# EasyEDA Pro project ProProject_MPF66200 _v0.2_2024-03-13_15-34-52_2024-03-26.epro

# Schematic MPF66200 _v0.2
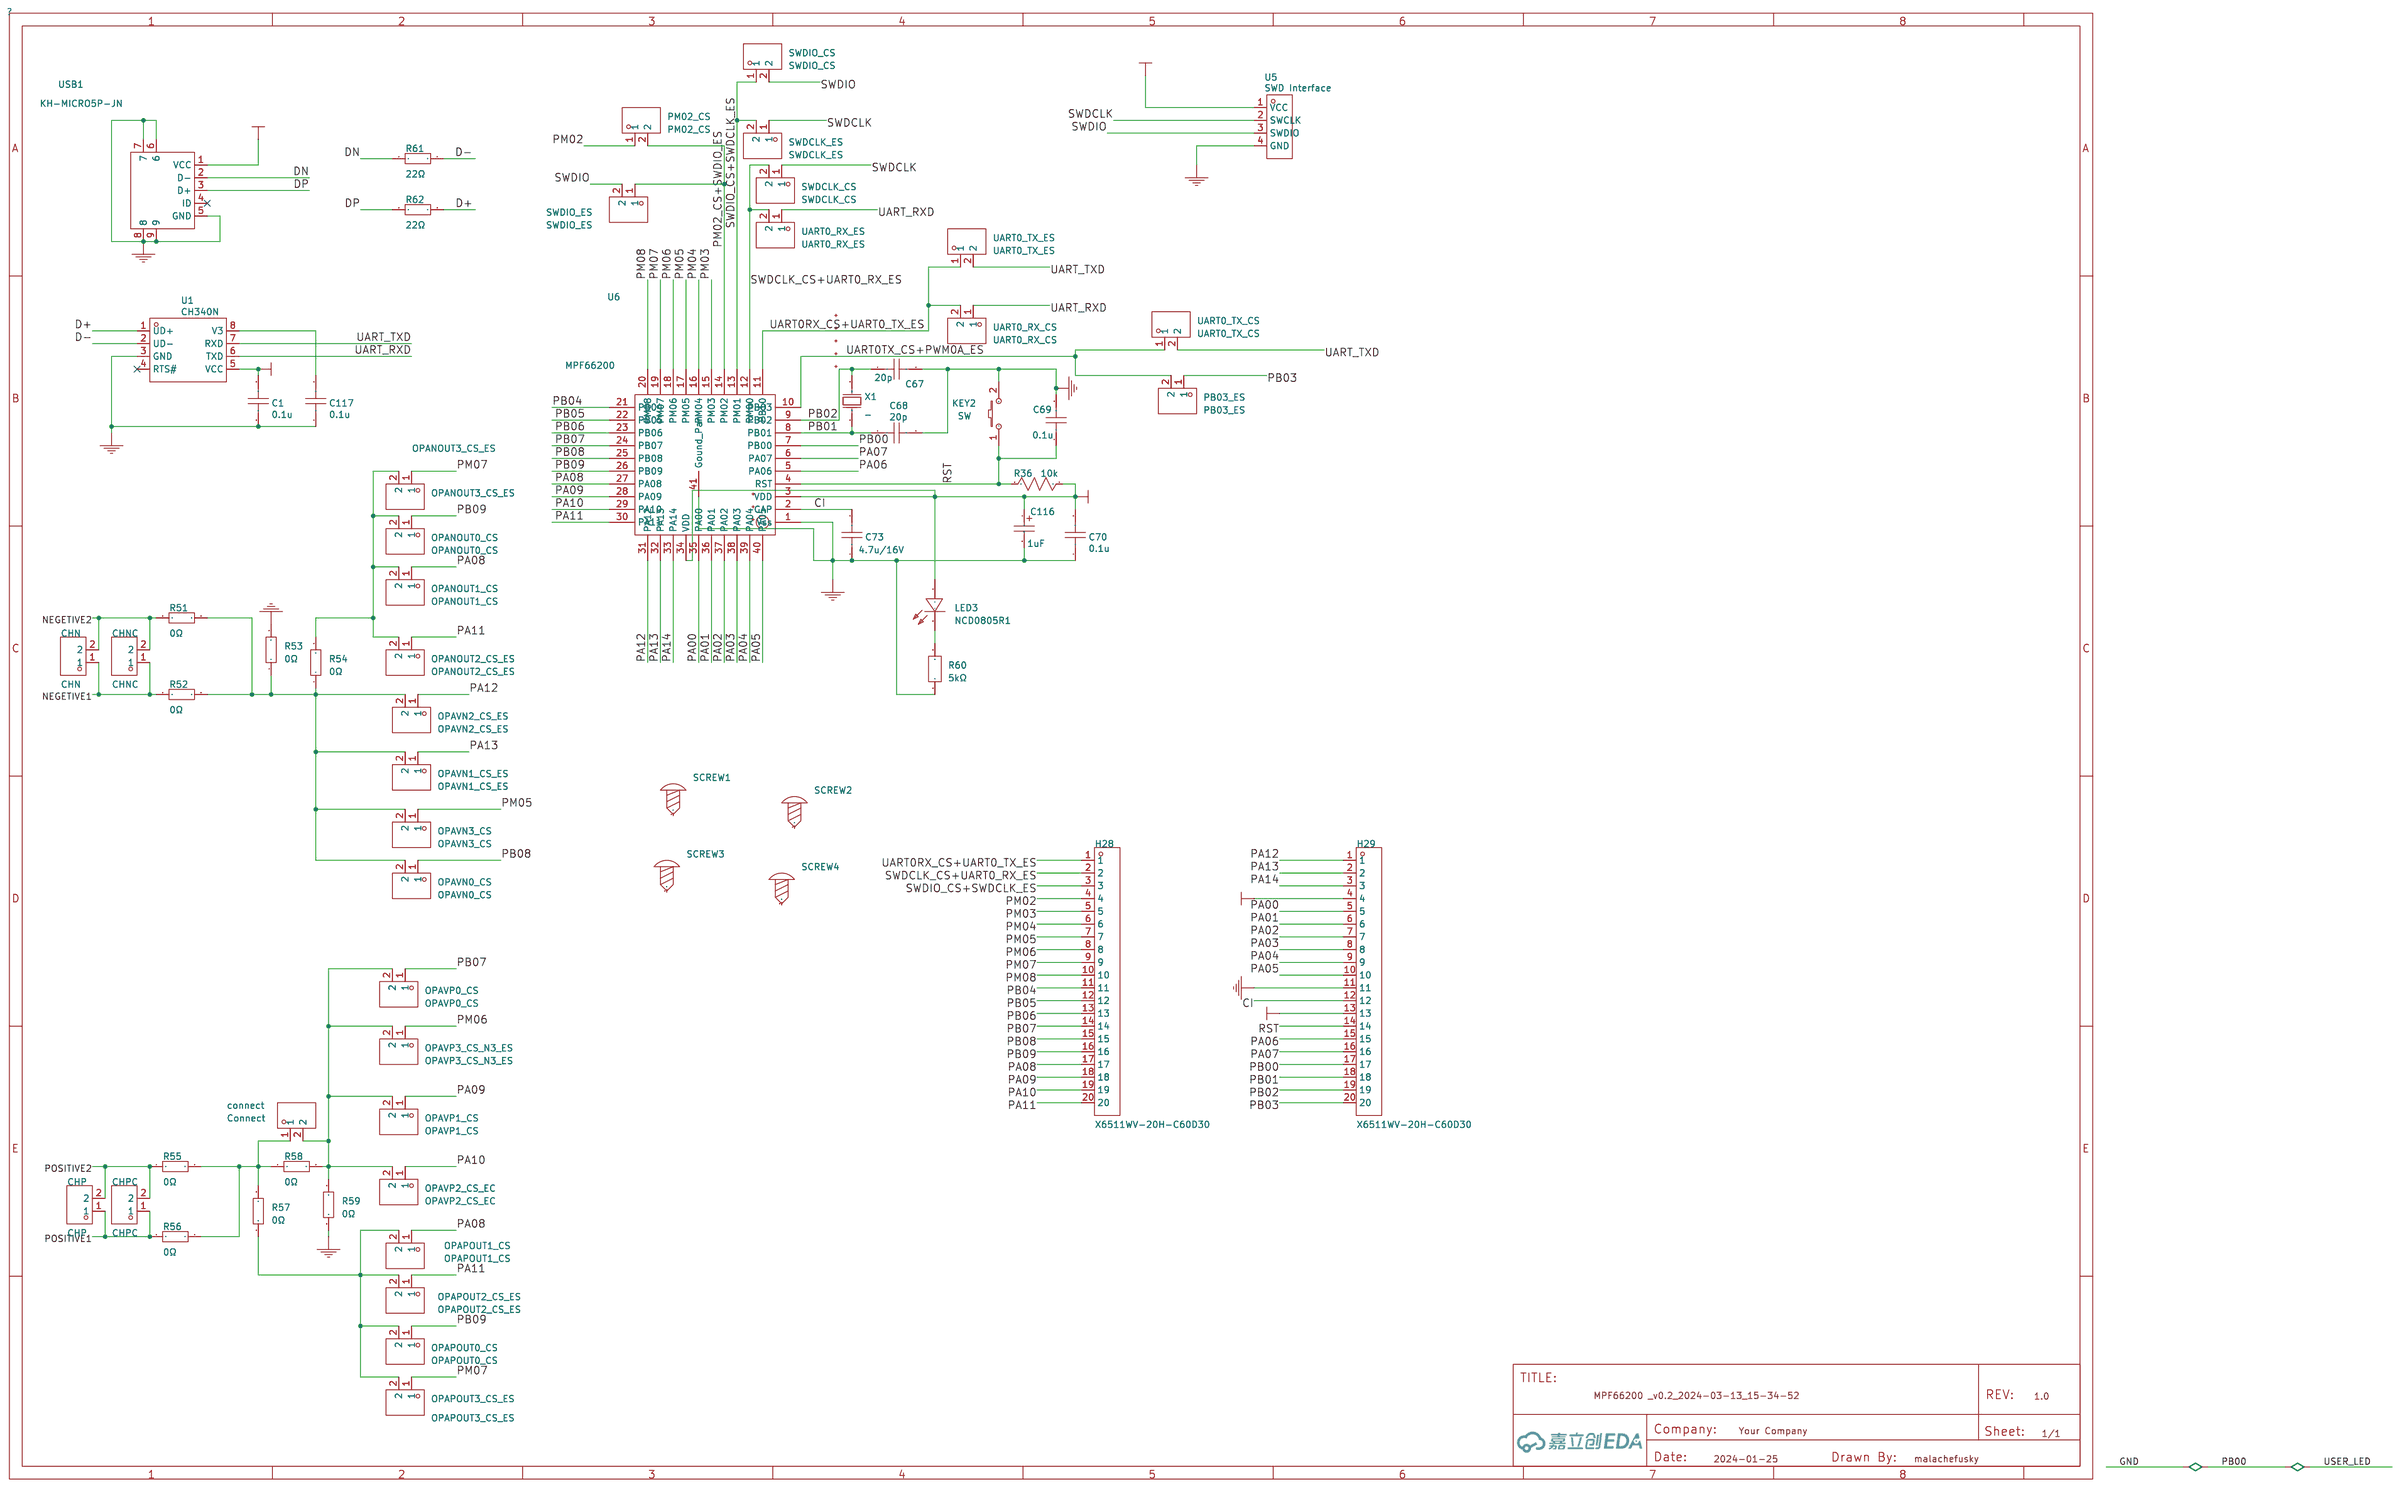
[diagram p0: schematic sheet]

## Parts
C1  0.1u  [C0805]
C67  20p  [C0805]
C68  20p  [C0805]
C69  0.1u  [C0805]
C70  0.1u  [C0805]
C73  4.7u/16V  [C0805]
C116  1uF  [CASE-A_3216]
C117  0.1u  [C0805]
CHN  CHN  [HDR-TH_2P-P2.54-V-M]
CHNC  CHNC  [HDR-TH_2P-P2.54-V-M]
CHP  CHP  [HDR-TH_2P-P2.54-V-M]
CHPC  CHPC  [HDR-TH_2P-P2.54-V-M]
connect  Connect  [HDR-TH_2P-P2.54-V-M]
H28  X6511WV-20H-C60D30  [HDR-TH_20P-P2.54-V-M]
H29  X6511WV-20H-C60D30  [HDR-TH_20P-P2.54-V-M]
KEY2  SW  [KEY-SMD_2P-L6.2-W3.6-LS8.0]
LED3  NCD0805R1  [LED0805-R-RD]
OPANOUT0_CS  OPANOUT0_CS  [HDR-TH_2P-P2.54-V-M]
OPANOUT1_CS  OPANOUT1_CS  [HDR-TH_2P-P2.54-V-M]
OPANOUT2_CS_ES  OPANOUT2_CS_ES  [HDR-TH_2P-P2.54-V-M]
OPANOUT3_CS_ES  OPANOUT3_CS_ES  [HDR-TH_2P-P2.54-V-M]
OPAPOUT0_CS  OPAPOUT0_CS  [HDR-TH_2P-P2.54-V-M]
OPAPOUT1_CS  OPAPOUT1_CS  [HDR-TH_2P-P2.54-V-M]
OPAPOUT2_CS_ES  OPAPOUT2_CS_ES  [HDR-TH_2P-P2.54-V-M]
OPAPOUT3_CS_ES  OPAPOUT3_CS_ES  [HDR-TH_2P-P2.54-V-M]
OPAVN0_CS  OPAVN0_CS  [HDR-TH_2P-P2.54-V-M]
OPAVN1_CS_ES  OPAVN1_CS_ES  [HDR-TH_2P-P2.54-V-M]
OPAVN2_CS_ES  OPAVN2_CS_ES  [HDR-TH_2P-P2.54-V-M]
OPAVN3_CS  OPAVN3_CS  [HDR-TH_2P-P2.54-V-M]
OPAVP0_CS  OPAVP0_CS  [HDR-TH_2P-P2.54-V-M]
OPAVP1_CS  OPAVP1_CS  [HDR-TH_2P-P2.54-V-M]
OPAVP2_CS_EC  OPAVP2_CS_EC  [HDR-TH_2P-P2.54-V-M]
OPAVP3_CS_N3_ES  OPAVP3_CS_N3_ES  [HDR-TH_2P-P2.54-V-M]
PB03_ES  PB03_ES  [HDR-TH_2P-P2.54-V-M]
PM02_CS  PM02_CS  [HDR-TH_2P-P2.54-V-M]
R36  10k  [C0805]
R51  0Ω  [R0805]
R52  0Ω  [R0805]
R53  0Ω  [R0805]
R54  0Ω  [R0805]
R55  0Ω  [R0805]
R56  0Ω  [R0805]
R57  0Ω  [R0805]
R58  0Ω  [R0805]
R59  0Ω  [R0805]
R60  5kΩ  [R0805]
R61  22Ω  [R0805]
R62  22Ω  [R0805]
SCREW1  -  [M2螺丝]
SCREW2  -  [M2螺丝]
SCREW3  -  [M2螺丝]
SCREW4  -  [M2螺丝]
SWDCLK_CS  SWDCLK_CS  [HDR-TH_2P-P2.54-V-M]
SWDCLK_ES  SWDCLK_ES  [HDR-TH_2P-P2.54-V-M]
SWDIO_CS  SWDIO_CS  [HDR-TH_2P-P2.54-V-M]
SWDIO_ES  SWDIO_ES  [HDR-TH_2P-P2.54-V-M]
U1  CH340N  [SOP-8_L5.0-W4.0-P1.27-LS6.0-BL]
U5  SWD Interface  [CONN-TH_4P-P2.50_4PIN]
U6  MPF66200  [VQFN-40_L6.0-W6.0-P0.50-TL-EP4.3]
UART0_RX_CS  UART0_RX_CS  [HDR-TH_2P-P2.54-V-M]
UART0_RX_ES  UART0_RX_ES  [HDR-TH_2P-P2.54-V-M]
UART0_TX_CS  UART0_TX_CS  [HDR-TH_2P-P2.54-V-M]
UART0_TX_ES  UART0_TX_ES  [HDR-TH_2P-P2.54-V-M]
USB1  KH-MICRO5P-JN  [MICRO-USB-SMD_KH-MICRO5P-JN]
X1  -  [HC-49US_L11.5-W4.5-P4.88]

## Library data of the parts
C1 C69 C70 C117 = 0.1u
C67 C68 = 20p
C73 = 4.7u/16V/1u
C116 = 1uF: Supplier: LCSC; Manufacturer: Sunlord(顺络); Manufacturer Part: TC211A105K035Y; Supplier Part: C128315; JLCPCB Part Class: Extended Part
CHN CHNC CHP CHPC connect OPANOUT0_CS OPANOUT1_CS OPANOUT2_CS_ES OPANOUT3_CS_ES OPAPOUT0_CS OPAPOUT1_CS OPAPOUT2_CS_ES OPAPOUT3_CS_ES OPAVN0_CS OPAVN1_CS_ES OPAVN2_CS_ES OPAVN3_CS OPAVP0_CS OPAVP1_CS OPAVP2_CS_EC OPAVP3_CS_N3_ES PB03_ES PM02_CS SWDCLK_CS SWDCLK_ES SWDIO_CS SWDIO_ES UART0_RX_CS UART0_RX_ES UART0_TX_CS UART0_TX_ES = PZ254V-11-02P: 插针结构:1x2P;间距:2.54mm;行距:-;圆针/方针:方针;安装类型:直插;排数:单排;总PIN位数:2P;额定电流:-;额定电压:-;配合针长度:6mm;塑高:2.5mm;端接针长度:3mm;触头材质:黄铜;触头镀层:-;工作温度范围:-40℃~+105℃;颜色:黑色;; LCSC Part Name: 间距:2.54mm 1x2P 直插 方针; Supplier Part: C492401; Manufacturer: XFCN(兴飞); Supplier Footprint: 插件,P=2.54mm; JLCPCB Part Class: 扩展库; Datasheet: https://atta.szlcsc.com/upload/public/pdf/source/20200309/C492401_A812433581A9B211A7FFA413ADDFF0E5.pdf; Supplier: LCSC; Pin Structure: 1x2P; Pitch: 2.54mm; Circluar Pins/Square Pins: 方针; Mounting Type: 直插; Number of Rows: 单排; Number of Pins: 2P; Length of Mating Pin: 6mm; Insulation Height: 2.5mm; Length of End Connection Pin: 3mm; Contact Material: 黄铜; Operating Temperature Range: -40℃~+105℃; Color: 黑色
H28 H29 = X6511WV-20H-C60D30: 插针结构:1x20P;间距:2.54mm;行距:2.54mm;圆针/方针:方针;安装类型:直插;排数:单排;总PIN位数:20P;额定电流:3A;额定电压:250V;配合针长度:6mm;塑高:2.5mm;端接针长度:3mm;触头材质:黄铜;触头镀层:金;工作温度范围:-40℃~+105℃;焊接温度(最大值):260℃;颜色:黑色;; LCSC Part Name: 1x20P 间距:2.54mm 方针 直插; Supplier Part: C725952; Manufacturer: XKB Connection(中国星坤); Supplier Footprint: 插件,P=2.54mm; JLCPCB Part Class: 扩展库; Datasheet: https://atta.szlcsc.com/upload/public/pdf/source/20221108/2FDDF9C694C8EDC81165E23F2EAAE597.pdf; Supplier: LCSC; Pin Structure: 1x20P; Pitch: 2.54mm; Row Spacing: 2.54mm; Circluar Pins/Square Pins: 方针; Mounting Type: 直插; Number of Rows: 单排; Number of Pins: 20P; Current Rating (Max): 3A; Voltage Rating (Max): 250V; Length of Mating Pin: 6mm; Insulation Height: 2.5mm; Length of End Connection Pin: 3mm; Contact Material: 黄铜; Contact Plating: 金; Operating Temperature Range: -40℃~+105℃; Soldering Temperature(Max): 260℃; Color: 黑色
KEY2 = SW: Supplier Part: C118141; Supplier: LCSC; Manufacturer Part: K2-1107ST-A4SW-06; 制造商: 韩国韩荣
LED3 = NCD0805R1: 灯头类型:-;发光颜色:红色;正向电压(VF):1.6V~2.6V;功率:65mW;正向电流:20mA;主波长:615nm~630nm;二极管配置:独立二极管;透镜颜色:无色透明透镜;色温:-;发光强度:67mcd~195mcd;发光角度:130°;载带方式:-;工作温度:-30℃~+85℃;; Supplier Part: C84256; Manufacturer: 国星光电; Supplier Footprint: 0805; JLCPCB Part Class: 基础库; Datasheet: https://atta.szlcsc.com/upload/public/pdf/source/20200820/C84256_F0A75A43B3EAD75808600A0514C76B99.pdf; Supplier: LCSC; Emitted Color: 红色; Forward Voltage (VF): 1.6V~2.6V; Power Dissipation: 65mW; Forward Current: 20mA; Dominant Wavelength: 615nm~630nm; Diode Configuration: 独立二极管; Lens Color: 无色透明透镜; Luminous Intensity: 67mcd~195mcd; Viewing Angle: 130°; Operating Temperature: -30℃~+85℃
R36 = 10k
R51-R59 = 0805W8F0000T5E: 电阻类型:厚膜电阻;阻值:0Ω;精度:±1%;功率:125mW;最大工作电压:150V;温度系数:±800ppm/℃;; LCSC Part Name: 0Ω ±1% 125mW 厚膜电阻; Supplier Part: C17477; Manufacturer: UNI-ROYAL(厚声); Supplier Footprint: 0805; JLCPCB Part Class: 基础库; Datasheet: https://atta.szlcsc.com/upload/public/pdf/source/20200306/C422600_1E6D84923E4A46A82E41ADD87F860B5C.pdf; Supplier: LCSC; Type: 厚膜电阻; Tolerance: ±1%; Power(Watts): 125mW; Overload Voltage (Max): 150V; Temperature Coefficient: ±800ppm/℃; Operating Temperature Range: -55℃~+155℃
R60 = RTT055001FTP: 电阻类型:厚膜电阻;阻值:5kΩ;精度:±1%;功率:125mW;最大工作电压:150V;温度系数:±100ppm/℃;; LCSC Part Name: 厚膜电阻 5kΩ ±1% 125mW; Supplier Part: C332873; Manufacturer: RALEC(旺诠); Supplier Footprint: 0805; JLCPCB Part Class: 扩展库; Datasheet: https://atta.szlcsc.com/upload/public/pdf/source/20191219/C158410_884373A5B7E1BC76BF57BC45A946C093.pdf; Supplier: LCSC; Type: 厚膜电阻; Tolerance: ±1%; Power(Watts): 125mW; Overload Voltage (Max): 150V; Temperature Coefficient: ±100ppm/℃; Operating Temperature Range: -55℃~+155℃
R61 R62 = 0805W8F220JT5E: 电阻类型:厚膜电阻;阻值:22Ω;精度:±1%;功率:125mW;最大工作电压:150V;温度系数:±100ppm/℃;; LCSC Part Name: 22Ω ±1% 125mW 厚膜电阻; Supplier Part: C17561; Manufacturer: UNI-ROYAL(厚声); Supplier Footprint: 0805; JLCPCB Part Class: 基础库; Datasheet: https://atta.szlcsc.com/upload/public/pdf/source/20200306/C422600_1E6D84923E4A46A82E41ADD87F860B5C.pdf; Supplier: LCSC; Type: 厚膜电阻; Tolerance: ±1%; Power(Watts): 125mW; Overload Voltage (Max): 150V; Temperature Coefficient: ±100ppm/℃; Operating Temperature Range: -55℃~+155℃
SCREW1-SCREW4 = M2螺丝: Supplier Footprint: 插件
U1 = CH340N: Supplier: LCSC; Supplier Part: C506813; Manufacturer: WCH(南京沁恒); JLCPCB Part Class: Extended Part
U5 = SWD Interface: Supplier: LCSC; Supplier Part: C7429634; Manufacturer: Megastar(兆星); Manufacturer Part: ZX-XH2.54-4PZZ; JLCPCB Part Class: Extended Part
U6 = MPF66200
USB1 = KH-MICRO5P-JN: Supplier: LCSC; Supplier Part: C962222; Manufacturer: Shenzhen Kinghelm Elec; JLCPCB Part Class: Extended Part
X1 = -: Supplier: LCSC; Manufacturer: HOSONIC(鸿星); Manufacturer Part: E49A25E00000XE10C0; Supplier Part: C112385; JLCPCB Part Class: Extended Part

## Nets
+5V: C1.2 C70.2 C116.1 H29.4 H29.13 LED3.1(+) R36.1 U1.5(VCC) U5.1(VCC) U6.3(VDD) U6.34(VDD) USB1.1(VCC)
GND: C1.1 C67.2 C68.2 C69.2 C70.1 C73.1 C116.2 C117.1 H29.11 H29.17 KEY2.2 R53.2 R59.1 R60.1 U1.3(GND) U5.4(GND) U6.1(Vss) U6.7(PB00) U6.41(Gound Pan) USB1.5(GND) USB1.6 USB1.7 USB1.8 USB1.9
CI: C73.2 H29.12 U6.2(CAP)
D+: R62.2 U1.1(UD+)
D-: R61.2 U1.2(UD-)
DN: R61.1 USB1.2(D-)
DP: R62.1 USB1.3(D+)
NEGETIVE1: CHN.1 CHNC.1 R52.1
NEGETIVE2: CHN.2 CHNC.2 R51.1
PA00: H29.5 U6.35(PA00)
PA01: H29.6 U6.36(PA01)
PA02: H29.7 U6.37(PA02)
PA03: H29.8 U6.38(PA03)
PA04: H29.9 U6.39(PA04)
PA05: H29.10 U6.40(PA05)
PA06: H29.15 U6.5(PA06)
PA07: H29.16 U6.6(PA07)
PA08: H28.17 OPANOUT1_CS.1 OPAPOUT1_CS.1 U6.27(PA08)
PA09: H28.18 OPAVP1_CS.1 U6.28(PA09)
PA10: H28.19 OPAVP2_CS_EC.1 U6.29(PA10)
PA11: H28.20 OPANOUT2_CS_ES.1 OPAPOUT2_CS_ES.1 U6.30(PA11)
PA12: H29.1 OPAVN2_CS_ES.1 U6.31(PA12)
PA13: H29.2 OPAVN1_CS_ES.1 U6.32(PA13)
PA14: H29.3 U6.33(PA14)
PB01: C68.1 H29.18 U6.8(PB01) X1.1(OSC1)
PB02: C67.1 H29.19 U6.9(PB02) X1.2(OSC2)
PB03: H29.20 PB03_ES.1
PB04: H28.11 U6.21(PB04)
PB05: H28.12 U6.22(PB05)
PB06: H28.13 U6.23(PB06)
PB07: H28.14 OPAVP0_CS.1 U6.24(PB07)
PB08: H28.15 OPAVN0_CS.1 U6.25(PB08)
PB09: H28.16 OPANOUT0_CS.1 OPAPOUT0_CS.1 U6.26(PB09)
PM02: H28.4 PM02_CS.1
PM02_CS+SWDIO_ES: PM02_CS.2 SWDIO_ES.1 U6.14(PM02)
PM03: H28.5 U6.15(PM03)
PM04: H28.6 U6.16(PM04)
PM05: H28.7 OPAVN3_CS.1 U6.17(PM05)
PM06: H28.8 OPAVP3_CS_N3_ES.1 U6.18(PM06)
PM07: H28.9 OPANOUT3_CS_ES.1 OPAPOUT3_CS_ES.1 U6.19(PM07)
PM08: H28.10 U6.20(PM08)
POSITIVE1: CHP.1 CHPC.1 R56.1
POSITIVE2: CHP.2 CHPC.2 R55.1
RST: C69.1 H29.14 KEY2.1 R36.2 U6.4(RST)
SWDCLK: SWDCLK_CS.1 SWDCLK_ES.1 U5.2(SWCLK)
SWDCLK_CS+UART0_RX_ES: H28.2 SWDCLK_CS.2 U6.12(PM00) UART0_RX_ES.2
SWDIO: SWDIO_CS.2 SWDIO_ES.2 U5.3(SWDIO)
SWDIO_CS+SWDCLK_ES: H28.3 SWDCLK_ES.2 SWDIO_CS.1 U6.13(PM01)
UART0RX_CS+UART0_TX_ES: H28.1 U6.11(PB10) UART0_RX_CS.2 UART0_TX_ES.1
UART0TX_CS+PWM0A_ES: PB03_ES.2 U6.10(PB03) UART0_TX_CS.1
UART_RXD: U1.6(TXD) UART0_RX_CS.1 UART0_RX_ES.1
UART_TXD: U1.7(RXD) UART0_TX_CS.2 UART0_TX_ES.2
$1N13: LED3.2(-) R60.2
$1N1417: C117.2 U1.8(V3)
$1N4052: OPAPOUT0_CS.2 OPAPOUT1_CS.2 OPAPOUT2_CS_ES.2 OPAPOUT3_CS_ES.2 R57.1
$1N5089: OPAVN0_CS.2 OPAVN1_CS_ES.2 OPAVN2_CS_ES.2 OPAVN3_CS.2 R51.2 R52.2 R53.1 R54.1
$1N10460: OPANOUT0_CS.2 OPANOUT1_CS.2 OPANOUT2_CS_ES.2 OPANOUT3_CS_ES.2 R54.2
$1N10784: connect.1 R55.2 R56.2 R57.2 R58.1
$1N10794: connect.2 OPAVP0_CS.2 OPAVP1_CS.2 OPAVP2_CS_EC.2 OPAVP3_CS_N3_ES.2 R58.2 R59.2

Not connected (* = marked no-connect by the designer): SCREW1 1; SCREW2 1; SCREW3 1; SCREW4 1; U1 4(RTS#)*; USB1 4(ID)*

# Board PCB2
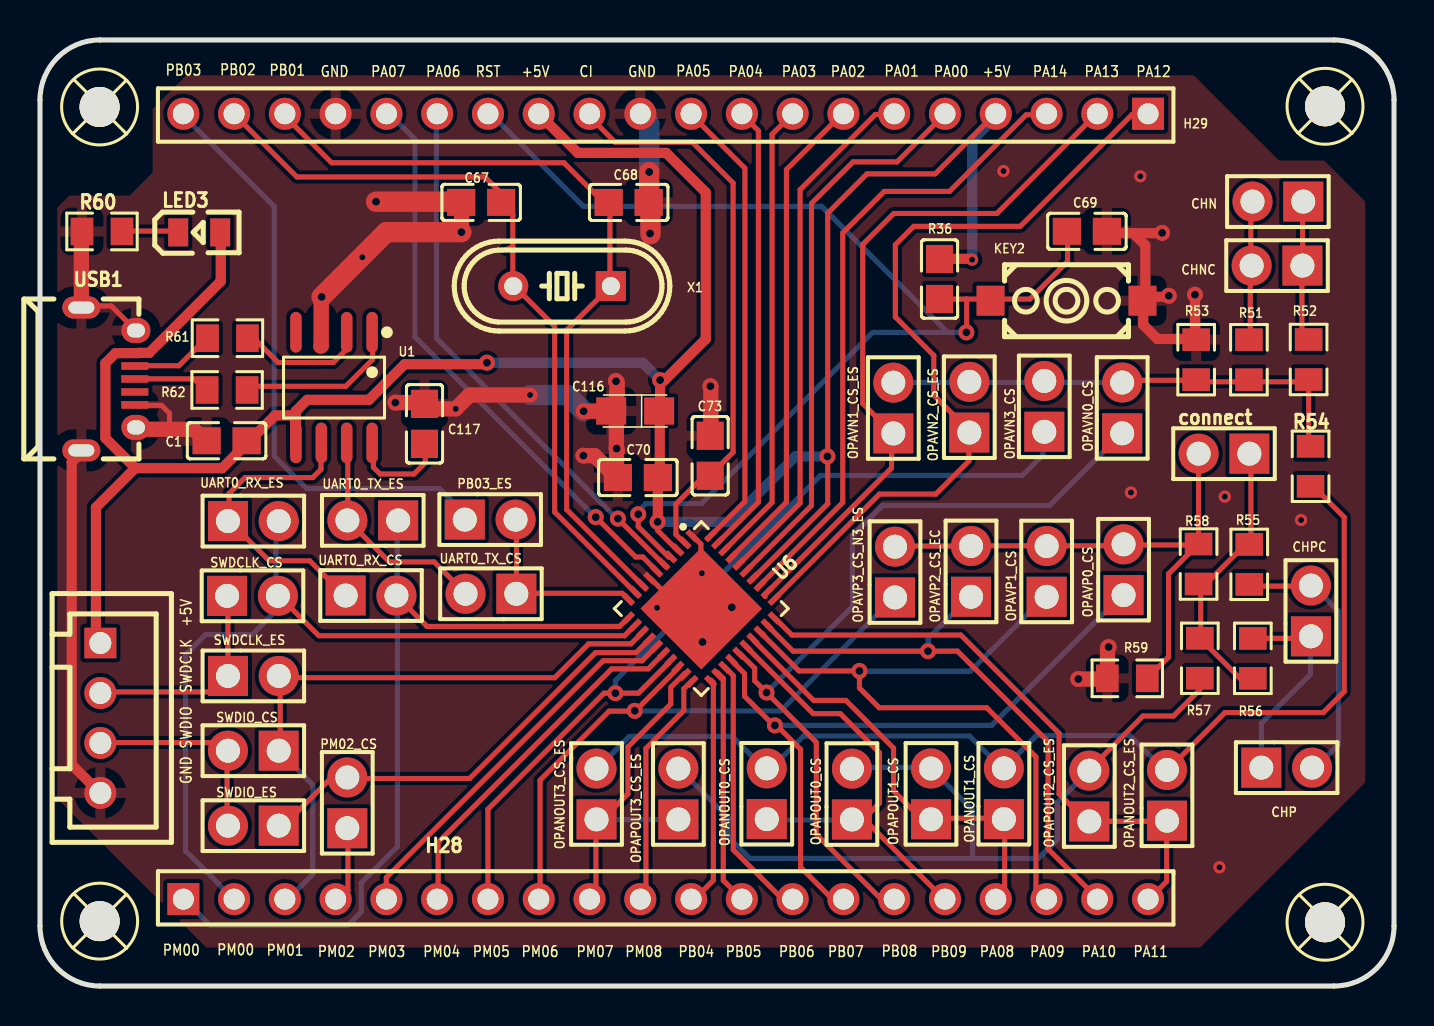
[diagram p1: board, top side]
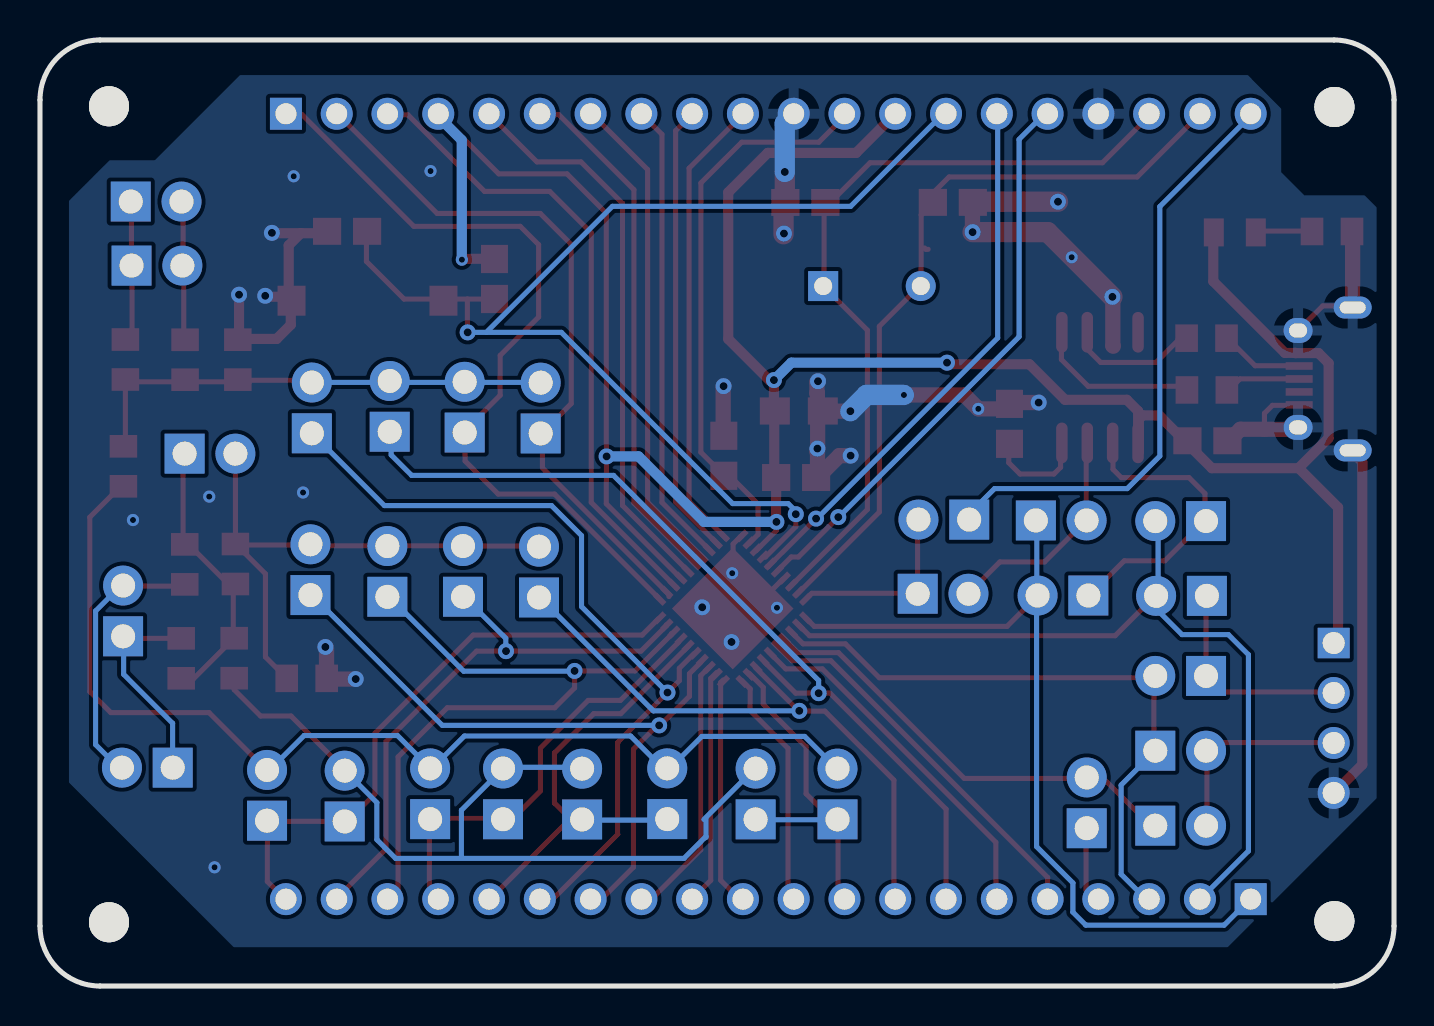
[diagram p2: board, bottom side, seen from below]

Outline 67.73 x 47.34 mm; copper layers: Top Layer, Bottom Layer. Coordinates in mm from the lower left corner of the outline.
Outline path: 0,44.34 0,3 arc(0.88,0.88) 3,0 64.73,0 arc(66.85,0.88) 67.73,3 67.73,44.34 arc(66.85,46.46) 64.73,47.34 3,47.34 arc(0.88,46.46) 0,44.34
Stack: Top Layer 0.035mm / Dielectric1 1.51mm FR4 er 4.5 / Bottom Layer 0.035mm

## Design rules (mm)
template: JLCPCB Capability(Two Layers Board)
spacing copperThickness1oz (default): track to track 0.102, other pairs 0.152 to 0.3
spacing copperThickness2oz: track to track 0.203, other pairs 0.152 to 0.3
track width copperThickness1oz (default): min 0.127, default 0.254, max 2.54
track width copperThickness2oz: min 0.203, default 0.254, max 2.54
differential pair differentialPair (default): width min 0.127, default 0.254, max 2.54; gap min 0.152, default 0.152
via viaSize (default): diameter min 0.5, default 0.61, max 10; hole min 0.3, default 0.305, max 6.3

## Placement (name value [footprint] x y rotation side)
C1  0.1u  [C0805]  9.33 27.28 0 top
C67  20p  [C0805]  22.07 39.21 180 top
C68  20p  [C0805]  29.45 39.21 0 top
C69  0.1u  [C0805]  52.37 37.76 0 top
C70  0.1u  [C0805]  29.91 25.44 0 top
C73  4.7u/16V  [C0805]  33.52 26.53 270 top
C116  1uF  [CASE-A_3216]  29.77 28.77 180 top
C117  0.1u  [C0805]  19.24 28.13 270 top
CHN  CHN  [HDR-TH_2P-P2.54-V-M]  61.92 39.25 180 top
CHNC  CHNC  [HDR-TH_2P-P2.54-V-M]  61.88 36.05 180 top
CHP  CHP  [HDR-TH_2P-P2.54-V-M]  62.36 10.93 0 top
CHPC  CHPC  [HDR-TH_2P-P2.54-V-M]  63.58 18.77 90 top
connect  Connect  [HDR-TH_2P-P2.54-V-M]  59.23 26.64 180 top
H28  X6511WV-20H-C60D30  [HDR-TH_20P-P2.54-V-M]  31.3 4.35 0 top
H29  X6511WV-20H-C60D30  [HDR-TH_20P-P2.54-V-M]  31.3 43.65 180 top
KEY2  SW  [KEY-SMD_2P-L6.2-W3.6-LS8.0]  51.35 34.29 0 top
LED3  NCD0805R1  [LED0805-R-RD]  7.97 37.71 0 top
OPANOUT0_CS  OPANOUT0_CS  [HDR-TH_2P-P2.54-V-M]  36.36 9.62 90 top
OPANOUT1_CS  OPANOUT1_CS  [HDR-TH_2P-P2.54-V-M]  48.22 9.62 90 top
OPANOUT2_CS_ES  OPANOUT2_CS_ES  [HDR-TH_2P-P2.54-V-M]  56.38 9.54 90 top
OPANOUT3_CS_ES  OPANOUT3_CS_ES  [HDR-TH_2P-P2.54-V-M]  27.84 9.61 90 top
OPAPOUT0_CS  OPAPOUT0_CS  [HDR-TH_2P-P2.54-V-M]  40.61 9.61 90 top
OPAPOUT1_CS  OPAPOUT1_CS  [HDR-TH_2P-P2.54-V-M]  44.57 9.62 90 top
OPAPOUT2_CS_ES  OPAPOUT2_CS_ES  [HDR-TH_2P-P2.54-V-M]  52.49 9.51 90 top
OPAPOUT3_CS_ES  OPAPOUT3_CS_ES  [HDR-TH_2P-P2.54-V-M]  31.93 9.61 90 top
OPAVN0_CS  OPAVN0_CS  [HDR-TH_2P-P2.54-V-M]  54.14 28.93 90 top
OPAVN1_CS_ES  OPAVN1_CS_ES  [HDR-TH_2P-P2.54-V-M]  42.69 28.92 90 top
OPAVN2_CS_ES  OPAVN2_CS_ES  [HDR-TH_2P-P2.54-V-M]  46.49 28.96 90 top
OPAVN3_CS  OPAVN3_CS  [HDR-TH_2P-P2.54-V-M]  50.24 29.01 90 top
OPAVP0_CS  OPAVP0_CS  [HDR-TH_2P-P2.54-V-M]  54.2 20.83 90 top
OPAVP1_CS  OPAVP1_CS  [HDR-TH_2P-P2.54-V-M]  50.36 20.75 90 top
OPAVP2_CS_EC  OPAVP2_CS_EC  [HDR-TH_2P-P2.54-V-M]  46.57 20.75 90 top
OPAVP3_CS_N3_ES  OPAVP3_CS_N3_ES  [HDR-TH_2P-P2.54-V-M]  42.77 20.71 90 top
PB03_ES  PB03_ES  [HDR-TH_2P-P2.54-V-M]  22.52 23.34 0 top
PM02_CS  PM02_CS  [HDR-TH_2P-P2.54-V-M]  15.37 9.17 90 top
R36  10k  [C0805]  45 35.38 270 top
R51  0Ω  [R0805]  60.48 31.34 270 top
R52  0Ω  [R0805]  63.46 31.35 270 top
R53  0Ω  [R0805]  57.84 31.34 90 top
R54  0Ω  [R0805]  63.56 26.01 270 top
R55  0Ω  [R0805]  60.49 21.1 90 top
R56  0Ω  [R0805]  60.67 16.4 270 top
R57  0Ω  [R0805]  58.02 16.4 90 top
R58  0Ω  [R0805]  57.96 21.12 90 top
R59  0Ω  [R0805]  54.39 15.4 0 top
R60  5kΩ  [R0805]  3.1 37.76 0 top
R61  22Ω  [R0805]  9.38 32.42 0 top
R62  22Ω  [R0805]  9.36 29.83 0 top
SCREW1  -  [M2螺丝]  2.98 43.99 0 top
SCREW2  -  [M2螺丝]  2.98 3.25 0 top
SCREW3  -  [M2螺丝]  64.28 44.02 0 top
SCREW4  -  [M2螺丝]  64.28 3.19 0 top
SWDCLK_CS  SWDCLK_CS  [HDR-TH_2P-P2.54-V-M]  10.63 19.52 0 top
SWDCLK_ES  SWDCLK_ES  [HDR-TH_2P-P2.54-V-M]  10.67 15.52 0 top
SWDIO_CS  SWDIO_CS  [HDR-TH_2P-P2.54-V-M]  10.67 11.78 180 top
SWDIO_ES  SWDIO_ES  [HDR-TH_2P-P2.54-V-M]  10.67 8.02 180 top
U1  CH340N  [SOP-8_L5.0-W4.0-P1.27-LS6.0-BL]  14.71 29.94 180 top
U5  SWD Interface  [CONN-TH_4P-P2.50_4PIN]  3.02 13.41 270 top
U6  MPF66200  [VQFN-40_L6.0-W6.0-P0.50-TL-EP4.3]  33.08 18.89 315 top
UART0_RX_CS  UART0_RX_CS  [HDR-TH_2P-P2.54-V-M]  16.56 19.54 0 top
UART0_RX_ES  UART0_RX_ES  [HDR-TH_2P-P2.54-V-M]  10.67 23.26 0 top
UART0_TX_CS  UART0_TX_CS  [HDR-TH_2P-P2.54-V-M]  22.56 19.63 180 top
UART0_TX_ES  UART0_TX_ES  [HDR-TH_2P-P2.54-V-M]  16.65 23.3 180 top
USB1  KH-MICRO5P-JN  [MICRO-USB-SMD_KH-MICRO5P-JN]  3.43 30.38 270 top
X1  -  [HC-49US_L11.5-W4.5-P4.88]  26.11 35.02 180 top

## Footprints (pads in the part's own frame, mm; a bottom-side part is the same pattern mirrored in y, then rotated)
C0805
  rect 1.41x1.35 smd: 1(-1,0) 2(1,0)
CASE-A_3216
  rect 1.5x1.359 smd: 1(-1.2,0) 2(1.2,0)
CONN-TH_4P-P2.50_4PIN
  rect 1.524x1.6 hole 1.1: 1(-3.75,0)
  round 1.6 hole 1.1: 2(-1.25,0) 3(1.25,0) 4(3.75,0)
HC-49US_L11.5-W4.5-P4.88
  rect 1.5x1.5 hole 0.9: 1(-2.44,0)
  round 1.5 hole 0.9: 2(2.44,0)
HDR-TH_2P-P2.54-V-M
  rect 2x2 hole 1.2: 1(-1.27,0)
  round 2 hole 1.2: 2(1.27,0)
HDR-TH_20P-P2.54-V-M
  rect 1.6x1.6 hole 1.05: 1(-24.13,0)
  round 1.6 hole 1.05: 2(-21.59,0) 3(-19.05,0) 4(-16.51,0) 5(-13.97,0) 6(-11.43,0) 7(-8.89,0) 8(-6.35,0) 9(-3.81,0) 10(-1.27,0) 11(1.27,0) 12(3.81,0) 13(6.35,0) 14(8.89,0) 15(11.43,0) 16(13.97,0) 17(16.51,0) 18(19.05,0) 19(21.59,0) 20(24.13,0)
KEY-SMD_2P-L6.2-W3.6-LS8.0
  rect 1.4x1.5 smd: 1(-3.8,0) 2(3.8,0)
LED0805-R-RD
  rect 1x1.399 smd: 1(1.05,0) 2(-1.05,0)
M2螺丝
  round 2 hole 2: 1(0,0)
MICRO-USB-SMD_KH-MICRO5P-JN
  rect 0.38x1.35 smd: 1(-1.3,1.31) 2(-0.65,1.31) 3(0,1.31) 4(0.65,1.31) 5(1.3,1.31)
  oval 1.25x1.45 hole 0.7x0.9: 6(2.425,1.365) 9(-2.425,1.365)
  oval 1.1x1.9 hole 0.6x1.3: 7(3.575,-1.365) 8(-3.575,-1.365)
R0805
  rect 1.133x1.377 smd: 1(-1,0) 2(1,0)
SOP-8_L5.0-W4.0-P1.27-LS6.0-BL
  oval 0.574x2.035 smd: 1(-1.905,-2.768) 2(-0.635,-2.768) 3(0.635,-2.768) 4(1.905,-2.768) 5(1.905,2.768) 6(0.635,2.768) 7(-0.635,2.768) 8(-1.905,2.768)
VQFN-40_L6.0-W6.0-P0.50-TL-EP4.3
  rect 0.665x0.28 smd: 1(-2.908,2.25) 2(-2.908,1.75) 3(-2.907,1.25) 4(-2.908,0.75) 5(-2.908,0.25) 6(-2.908,-0.25) 7(-2.908,-0.75) 8(-2.907,-1.25) 9(-2.908,-1.75) 10(-2.908,-2.25) 21(2.908,-2.25) 22(2.908,-1.75) 23(2.907,-1.25) 24(2.908,-0.75) 25(2.908,-0.25) 26(2.908,0.25) 27(2.908,0.75) 28(2.907,1.25) 29(2.908,1.75) 30(2.908,2.25)
  rect 0.28x0.665 smd: 11(-2.25,-2.908) 12(-1.75,-2.908) 13(-1.25,-2.907) 14(-0.75,-2.908) 15(-0.25,-2.908) 16(0.25,-2.908) 17(0.75,-2.908) 18(1.25,-2.907) 19(1.75,-2.908) 20(2.25,-2.908) 31(2.25,2.908) 32(1.75,2.908) 33(1.25,2.907) 34(0.75,2.908) 35(0.25,2.908) 36(-0.25,2.908) 37(-0.75,2.908) 38(-1.25,2.907) 39(-1.75,2.908) 40(-2.25,2.908)
  rect 4.3x4.3 smd: 41(0,0)

## Nets
As in the schematic.

Pads without a net: SCREW1 1; SCREW2 1; SCREW3 1; SCREW4 1; U1 4; USB1 4

## Via types
v1: diameter 0.8, hole 0.399, Top Layer to Bottom Layer, 32 vias
v2: diameter 0.61, hole 0.305, Top Layer to Bottom Layer, 12 vias

## Routing (per net, layer and track width the routed paths; a pad name or vN(x,y) marks a point on that pad's centre or on a via; arc(x,y) is an arc through that point)
+5V: length 136.7
  Top Layer w0.254: 30.9,23.23 30.9,22.79 31.92,21.78 ; 35.55,20.27 39.4,24.13 39.4,38.67 41.37,40.64 44.78,40.64 47.82,43.68 ; 30.91,23.23 30.91,23.24 ; 10.47,27.24 10.44,27.24 10.4,27.2
  Top Layer w0.508: v1(22.36,31.19) 22.28,31.11 18.24,31.11 16.46,29.33 13.36,29.33 12.8,28.77 12.8,27.36 12.76,27.33 ; 10.44,27.24 11.75,28.55 12.57,28.55 12.76,28.36 12.76,27.33 ; 30.95,25.45 31,25.51 31,28.61 ; 2.8,17.05 2.8,23.95 4.71,25.86 ; 12.76,27.33 12.76,26.74 12.81,26.7 ; 31,28.61 30.96,28.57 ; 31,28.61 31.02,28.63 v1(31.02,30.32) 31.25,30.32 33.3,32.37 33.3,39.71 31.33,41.69 26.91,41.69 25.09,43.51 ; 9.02,38.01 9.04,37.99 9.04,35.26 5.46,31.68 4.94,31.68 4.93,31.67 3.77,31.67 3.27,31.17 3.27,27.42 4.78,25.91 9.11,25.91 10.4,27.2 ; 30.91,25.62 30.91,23.24 v1(30.89,23.22) ; v2(46.63,36.34) 46.58,36.39 45.14,36.39
  Bottom Layer w0.508: v1(30.89,23.22) 34.51,23.22 37.79,26.5 v1(39.39,26.5) ; 47.88,43.58 46.64,42.33 46.64,36.35 ; v1(31.02,30.32) 30.15,31.19 v1(22.36,31.19)
GND: length 101.5
  Top Layer w0.254: 4.75,29.06 6.08,29.06 6.48,28.66 6.48,27.72 ; 32.7,22.48 33.06,22.12 33.06,20.14 ; 32.7,22.48 32.66,22.48 ; 32.7,22.48 32.59,22.59 ; 2.08,34.03 3.56,34.03 4.75,32.84 ; 30.58,20.36 32.03,18.91 33.06,18.91 ; 28.83,28.76 28.84,28.75
  Top Layer w0.508: 54.69,37.67 53.43,37.67 ; 54.69,37.67 56.11,37.67 v1(56.13,37.69) ; 54.69,37.67 55.29,37.06 55.29,34.59 55.19,34.49 ; 55.19,34.49 56.42,34.49 v1(56.47,34.54) ; 55.19,34.49 55.19,33.09 55.9,32.38 57.86,32.38 57.78,32.47 v1(57.78,34.59) ; 3.12,9.54 1.59,11.07 1.59,26.22 2.16,26.79
  Top Layer w0.762: 2.07,37.65 2.07,34.05 2.1,34.02 ; 4.82,27.86 7.68,27.86 8.48,27.07 ; v1(17.78,29.19) 19.33,29.19 19.65,28.88 v2(20.8,28.88) 21.49,29.57 v2(24.52,29.57) ; v1(28.84,26.89) 28.83,26.91 28.83,28.74 28.84,28.75 28.84,29.67 28.87,29.67 28.87,30.22 28.8,30.29 ; 18.1,39.25 18.12,39.27 21.09,39.27 21.09,37.72 21.11,37.7 ; v1(51.94,15.36) 53.36,15.36 53.42,15.42 53.4,15.44 53.4,16.93 ; v1(33.54,30.02) 33.56,30 33.56,27.57 ; 28.88,26.77 28.84,26.73 28.84,25.44 27.75,26.54 v1(27.18,26.54) ; v1(14.09,34.48) 14.07,34.46 14.07,32.04 14.04,32.02 ; v1(27.2,28.76) 28.83,28.76
  Top Layer w1.016: 30.48,39.23 30.54,39.17 30.54,37.62 ; 30.43,39.44 30.48,39.48 v1(30.48,40.73) ; v1(14.09,34.48) 17.33,37.72 v1(21.08,37.72) ; 21.02,39.27 20.99,39.25 v1(16.81,39.25)
  Bottom Layer w1.016: v2(24.52,29.57) 26.39,29.57 v1(27.2,28.76) ; v1(30.48,40.73) 30.48,43.15 30.01,43.62
  vias: v1(28.82,30.26) v1(30.52,37.65) v1(33.14,17.22) v1(34.61,18.95) v1(53.46,16.97) v2(16.12,36.47) v2(30.87,18.93) v2(33.11,20.66) v2(48.2,40.78) v2(54.57,24.7) v2(55.04,40.52) v2(59,5.94) v2(59.27,24.49) v2(63.08,23.32)
CI: length 28.5
  Top Layer w0.254: 33.51,25.55 33.29,25.33 33.21,25.33 ; 33.51,25.55 33.24,25.55 31.81,24.12 31.81,22.6 32.27,22.13 ; 33.51,25.55 34.67,26.71 34.67,40.18 32.63,42.22 28.77,42.22 27.49,43.51
D+: length 8.5
  Top Layer w0.254: 16.64,33.04 16.64,31.35 15.3,30.01 10.41,30.01
D-: length 6.7
  Top Layer w0.254: 10.68,32.44 11.91,31.2 14.67,31.2 15.36,31.89 15.36,33.1
DN: length 4.3
  Top Layer w0.254: 4.68,31.04 6.95,31.04 8.2,32.29 8.45,32.29
DP: length 3.8
  Top Layer w0.254: 8.33,29.76 7.7,30.38 4.76,30.38
NEGETIVE1: length 7.1
  Top Layer w0.254: 63.5,32.49 63.13,32.86 63.13,35.8 63.04,35.89 ; 63.08,35.95 63.16,36.02 63.16,39.41
NEGETIVE2: length 6.9
  Top Layer w0.254: 60.57,39.22 60.57,36.25 60.54,36.22 60.54,32.49 60.45,32.4
PA00: length 28.5
  Top Layer w0.254: 45.33,43.69 42.87,41.24 40.67,41.24 38.59,39.16 38.59,24.04 35.2,20.65
PA01: length 26.5
  Top Layer w0.254: 34.83,20.97 38.02,24.17 38.02,39.85 41.79,43.61 42.73,43.61
PA02: length 24.7
  Top Layer w0.254: 34.49,21.36 37.34,24.21 37.34,40.85 40.16,43.67
PA03: length 23.4
  Top Layer w0.254: 37.67,43.66 36.62,42.62 36.62,24.2 34.17,21.75
PA04: length 22.8
  Top Layer w0.254: 35.1,43.63 35.94,42.8 35.94,24.21 33.77,22.05
PA05: length 23.1
  Top Layer w0.254: 33.4,22.4 33.41,22.4 35.26,24.25 35.26,40.92 32.58,43.61
PA06: length 27.5
  Top Layer w0.254: 31.36,20.98 31.31,20.98 28.91,23.38 v1(28.91,23.39)
  Bottom Layer w0.254: 20.01,43.64 19.83,43.46 19.83,32.43 28.85,23.4 28.85,23.37
PA07: length 28.8
  Top Layer w0.254: 27.8,23.46 29.79,21.47 30.15,21.47 30.88,20.74
  Bottom Layer w0.254: 17.42,43.69 18.76,42.36 18.76,32.49 27.82,23.42
  vias: v1(27.8,23.46)
PA08: length 21.4
  Top Layer w0.254: 48.15,8.37 48.13,8.4 44.7,8.4 ; 44.59,8.34 44.12,8.34 42.7,9.76 42.7,11.9 40.31,14.29 38.7,14.29 35.77,17.22 ; 48.26,8.33 48.26,4.78 47.78,4.3
PA09: length 35.2
  Top Layer w0.254: 36.15,17.63 36.15,17.59 37.97,15.77 v1(40.99,15.77) 40.99,14.92 41.98,13.92 47.36,13.92 49.82,11.47 49.82,4.81 50.32,4.31 50.45,4.31
  Bottom Layer w0.254: 50.37,19.44 50.23,19.44 46.54,15.75 41,15.75 v1(40.99,15.77)
PA10: length 29
  Top Layer w0.254: 36.4,18.08 36.4,18.03 37.67,16.76 v1(44.42,16.76) 45.89,16.76 50.43,12.22 50.43,6.86 52.94,4.35 52.94,4.22
  Bottom Layer w0.254: 44.43,16.76 44.43,17.4 46.45,19.42
PA11: length 30.3
  Top Layer w0.254: 56.36,8.33 56.36,8.24 ; 56.36,8.24 52.47,8.24 ; 56.36,8.24 56.36,5.23 55.44,4.31 ; 36.79,18.38 37.61,17.56 46.06,17.56 50.98,12.65 50.98,9.61 52.42,8.18 52.82,8.18
PA12: length 40.1
  Top Layer w0.254: 36.83,19.45 41.99,24.62 44.82,24.62 46.47,26.27 46.47,27.81 44.71,29.56 44.71,31.55 42.79,33.48 42.79,37.09 43.71,38.01 49.04,38.01 54.64,43.62 55.4,43.62
PA13: length 35.5
  Top Layer w0.254: 36.27,19.49 36.27,19.6 42.6,25.92 42.6,27.7 ; 42.6,27.7 42.62,27.72 42.78,27.72 42.85,27.8 ; 42.6,27.7 41.16,29.14 41.16,37.11 42.71,38.66 47.86,38.66 52.82,43.61
PA14: length 32.2
  Top Layer w0.254: 50.37,43.59 49.33,43.59 45.5,39.76 42.23,39.76 40.16,37.68 40.16,24.2 35.9,19.94 35.9,19.91
PB01: length 40.2
  Top Layer w0.254: 28.62,35.1 28.53,35.01 ; 28.53,35.01 28.51,35.07 28.51,39.29 ; 28.53,35.01 26.35,32.82 26.35,23.84 30.28,19.9 ; 28.51,39.29 28.51,39.31 ; 28.51,39.29 28.11,39.29 26.21,41.19 14.59,41.19 12.16,43.62
PB02: length 38.5
  Top Layer w0.254: 29.91,19.56 25.75,23.72 25.75,33.01 23.65,35.1 ; 23.65,35.1 23.64,35.11 ; 23.65,35.1 23.65,38.59 23.03,39.21 ; 23.65,35.1 23.65,35.03 ; 23.3,36.86 23.42,36.86 23.48,36.93 ; 23.1,39.19 23.1,39.65 22.26,40.48 12.85,40.48 9.59,43.74
PB03: length 30
  Bottom Layer w0.254: 21.26,23.3 21.26,23.61 19.98,24.89 13.35,24.89 11.71,26.52 11.71,39 7.17,43.55
PB04: length 11.7
  Top Layer w0.254: 33.56,15.31 33.68,15.19 33.68,5.29 32.69,4.29 32.45,4.29
PB05: length 11.9
  Top Layer w0.254: 33.87,15.7 34.18,15.39 34.18,5.29 35.13,4.34
PB06: length 13.4
  Top Layer w0.254: 34.26,15.95 34.68,15.53 34.68,6.82 37.15,4.35 37.71,4.35
PB07: length 34.9
  Top Layer w0.254: 34.67,16.2 35.24,15.63 35.24,14.5 36.7,13.04 v1(36.76,13.04) 36.85,13.04 38.05,11.85 38.05,5.94 39.67,4.32 40.42,4.32
  Bottom Layer w0.254: v1(36.76,13.04) 47.61,13.04 54.18,19.61
PB08: length 41.2
  Top Layer w0.254: 35.01,16.64 35.75,15.9 35.75,15.28 v1(36.34,14.69) 38.83,12.19 38.83,7.59 42.08,4.35 42.81,4.35
  Bottom Layer w0.254: 54.14,27.68 50.51,24.04 42.15,24.04 40.64,22.54 40.64,18.99 v1(36.34,14.69)
PB09: length 23.8
  Top Layer w0.254: 45.27,4.3 41.27,8.3 40.65,8.3 40.61,8.33 ; 40.57,8.37 40.61,8.33 ; 40.61,8.33 41.17,8.33 42,9.15 42,11.67 40.03,13.63 38.68,13.63 35.29,17.02
  Bottom Layer w0.254: 36.4,8.3 40.71,8.3
PM02: length 3.9
  Top Layer w0.254: 14.84,4.22 15.4,4.79 15.4,7.9
PM02_CS+SWDIO_ES: length 22.7
  Top Layer w0.254: 15.4,10.39 21.5,10.39 27.79,16.68 29.82,16.68 30.59,17.45 ; 15.4,10.43 14.59,10.43 11.91,7.76
PM03: length 19.6
  Top Layer w0.254: 30.94,17.1 30.12,16.28 28.17,16.28 17.33,5.43 17.33,4.3
PM04: length 18.2
  Top Layer w0.254: 19.92,4.31 19.92,7.19 28.6,15.87 30.43,15.87 31.29,16.73
PM05: length 44.8
  Top Layer w0.254: 31.48,16.21 29.93,14.65 v1(28.78,14.65) 28.21,14.65 22.41,8.85 22.41,4.31
  Bottom Layer w0.254: v1(28.78,14.65) 28.78,15.29 39.04,25.55 49.14,25.55 50.17,26.58 50.17,28
PM06: length 30.6
  Top Layer w0.254: 31.95,15.94 29.77,13.76 28.47,13.76 25.02,10.3 25.02,4.34
  Bottom Layer w0.254: v1(29.75,13.77) 37.05,13.77 42.76,19.48
PM07: length 17.5
  Top Layer w0.254: 27.54,4.4 27.81,4.67 27.81,8.31 ; 32.26,15.66 31.55,14.95 31.55,14.11 29.41,11.97 29.41,9.62 28.13,8.34 27.84,8.34
  Bottom Layer w0.254: 27.86,8.32 31.91,8.32 31.97,8.38
PM08: length 12.4
  Top Layer w0.254: 30.31,3.84 30.31,11.89 32.21,13.78 32.21,14.87 32.63,15.3
POSITIVE1: length 10.9
  Top Layer w0.254: 60.54,17.4 63.58,17.4 63.6,17.38
  Bottom Layer w0.254: 63.55,17.67 63.55,15.6 61.1,13.15 61.1,10.88 61.08,10.86
POSITIVE2: length 13.6
  Top Layer w0.254: 60.52,20.01 63.67,20.01 63.68,20.02
  Bottom Layer w0.254: 63.61,10.74 64.95,12.08 64.95,18.77 63.65,20.06
RST: length 60.8
  Top Layer w0.254: 46.38,32.81 46.36,32.83 46.36,34.37 ; 46.36,34.37 49.52,34.37 51.4,36.26 51.4,37.89 ; 46.36,34.37 45.13,34.37 ; 31.56,21.47 31.45,21.47 29.93,22.99 v1(29.93,23.61)
  Bottom Layer w0.254: v1(29.93,23.61) 29.93,23.76 30.31,24.14 33.08,24.14 41.65,32.71 45.4,32.71 ; 45.4,32.71 39.1,39.01 27.18,39.01 22.58,43.61 ; 45.4,32.71 v1(46.34,32.71)
SWDCLK: length 10.7
  Top Layer w0.254: 3.06,14.71 8.62,14.71 9.39,15.49 ; 9.34,15.58 9.4,15.64 9.4,19.63
SWDCLK_CS+UART0_RX_ES: length 42.1
  Top Layer w0.254: 29.83,18.12 29.24,17.53 13.95,17.53 11.94,19.53
  Bottom Layer w0.254: 11.8,23.12 11.8,19.53 11.84,19.5 ; 11.82,19.45 11.82,18.8 10.61,17.58 8.29,17.58 7.28,16.58 7.28,6.75 9.79,4.25
SWDIO: length 10.4
  Top Layer w0.254: 9.36,11.8 9.36,11.86 9.38,11.88 ; 9.36,11.8 8.98,12.19 2.98,12.19 ; 9.36,11.8 9.36,8.05
SWDIO_CS+SWDCLK_ES: length 32
  Top Layer w0.254: 11.99,11.56 12.01,11.58 12.01,15.51 ; 30.23,17.79 29.56,17.12 27.44,17.12 25.75,15.43 12.03,15.43 ; 12.04,15.52 12.04,15.52 12.04,15.52 12.04,15.52
  Bottom Layer w0.254: 12.23,4.17 13.65,5.59 13.65,10.06 11.98,11.73
UART0RX_CS+UART0_TX_ES: length 43.1
  Top Layer w0.254: 29.46,18.46 29,18 19.36,18 17.86,19.49
  Bottom Layer w0.254: 15.42,3.05 16.06,3.7 16.06,5.16 17.88,6.98 17.88,19.25 17.79,19.34 ; 7.2,4.34 8.5,3.05 15.42,3.05 ; 17.79,19.34 17.79,19.66 17.87,19.74 ; 17.79,19.34 17.72,19.27 ; 17.79,19.34 17.87,19.42 17.87,19.74 ; 17.87,19.74 17.87,23.24 ; 17.87,19.74 17.92,19.8
UART0TX_CS+PWM0A_ES: length 9.8
  Top Layer w0.254: 29.57,19.21 29.12,19.65 23.83,19.65 ; 23.79,23.4 23.83,23.35 23.83,19.65 ; 23.81,19.55 23.83,19.55 23.83,19.65
UART_RXD: length 15.3
  Top Layer w0.254: 15.25,19.44 15.25,19.52 13.49,21.28 11.47,21.28 9.52,23.22 ; 14.06,27.38 14.06,25.86 13.64,25.44 10.25,25.44 9.46,24.64 9.46,23.29
UART_TXD: length 11.7
  Top Layer w0.254: 21.3,19.36 21.3,19.63 19.71,21.22 17.48,21.22 15.41,23.29 ; 15.27,27.38 15.4,27.25 15.4,23.46
$1N13: length 2.8
  Top Layer w0.254: 6.89,37.77 6.88,37.78 4.08,37.78
$1N1417: length 5.4
  Top Layer w0.254: 16.58,27.29 16.68,27.19 16.68,25.95 17.01,25.62 18.71,25.62 19.27,26.18 19.27,27.21
$1N4052: length 43.7
  Top Layer w0.254: 52.46,10.8 55.17,13.51 56.7,13.51 58.02,14.83 58.02,15.5 ; 52.46,10.8 52.55,10.7 ; 52.46,10.8 52.43,10.77
  Bottom Layer w0.254: 31.75,10.9 31.95,10.9 34.52,8.33 ; 52.48,10.78 50.88,9.18 50.88,7.33 49.95,6.39 35.52,6.39 ; 34.42,8.33 34.42,7.48 ; 34.42,7.48 34.42,7.43 ; 34.42,7.48 35.52,6.38 ; 40.61,10.81 40.74,10.94 44.5,10.94 44.55,10.9 ; 44.55,10.9 44.63,10.9 ; 44.55,10.9 46.65,8.8 46.65,6.45
$1N5089: length 24
  Top Layer w0.254: 63.07,30.24 57.34,30.24 57.29,30.18 57.32,30.18 ; 54.29,30.31 57.83,30.31 57.86,30.28 ; 63.55,30.35 63.46,30.26 63.46,27.18
  Bottom Layer w0.254: 42.59,30.2 53.91,30.2 53.94,30.17
$1N10460: length 54.3
  Top Layer w0.254: 36.41,10.91 36.19,10.91 35.95,11.15 ; 63.6,25.1 65.24,23.46 65.24,14.73 64.19,13.68 59.28,13.68 56.41,10.82
  Bottom Layer w0.254: 56.42,10.67 56.38,10.67 54.52,12.53 49.86,12.53 ; 48.21,10.9 49.86,12.54 ; 36.05,11.06 34.62,12.49 29.48,12.49 27.87,10.88 27.87,10.87 ; 48.17,10.92 48.09,10.92 46.5,12.51 38.19,12.51 36.65,10.96 36.36,10.96
$1N10784: length 14.4
  Top Layer w0.254: 60.74,15.38 60.05,15.38 58.06,17.36 58.06,19.84 57.83,20.08 58.27,20.08 60.27,22.07 60.52,22.07 60.57,22.13 60.57,26.6
$1N10794: length 27.5
  Top Layer w0.254: 57.87,26.57 57.95,26.49 57.95,22.13 ; 54.19,22.07 57.9,22.07 ; 54.19,22.07 54.26,22.14 ; 54.19,22.07 54.15,22.03 50.39,22.03 ; 57.9,22.07 57.95,22.13 ; 57.9,22.07 56.45,20.62 56.45,16.46 55.47,15.48 ; 57.95,22.13 58,22.17 ; 46.64,21.99 46.61,22.01 42.77,22.01 ; 46.57,22.03 50.37,22.03 50.39,22.04

## Copper pours and planes (outline as drawn; the poured copper is in the pictures)
GND on Top Layer: 7.1,45.35 5.64,43.89 5.64,40.71 4.48,39.55 1.46,39.55 0.86,38.95 0.86,9.38 8.31,1.93 58.04,1.93 66.29,10.18 66.29,39.26 64.24,41.31 61.98,41.31 57.72,45.57 7.3,45.57 7.09,45.35
GND on Bottom Layer: 7.11,45.37 5.64,43.9 5.64,40.72 4.49,39.57 1.47,39.57 0.87,38.96 0.87,9.39 8.32,1.94 58.04,1.94 66.28,10.18 66.28,39.29 64.25,41.32 61.98,41.32 57.73,45.58 7.31,45.58 7.09,45.37

## Text on the board
Top Silkscreen Layer: PM00 | PB03 | PB02 | PM01 | PB01 | PM02 | GND | PM03 | PA07 | PM04 | PA06 | PM05 | RST | PM06 | +5V | PM07 | CI | PM08 | PA05 | PB04 | PB05 | PA04 | PB06 | PA03 | PB07 | PA02 | PB08 | PA01 | PB09 | PA00 | PA08 | PA09 | PA14 | PA10 | PA13 | PA11 | PA12 | SWDCLK | SWDIO
